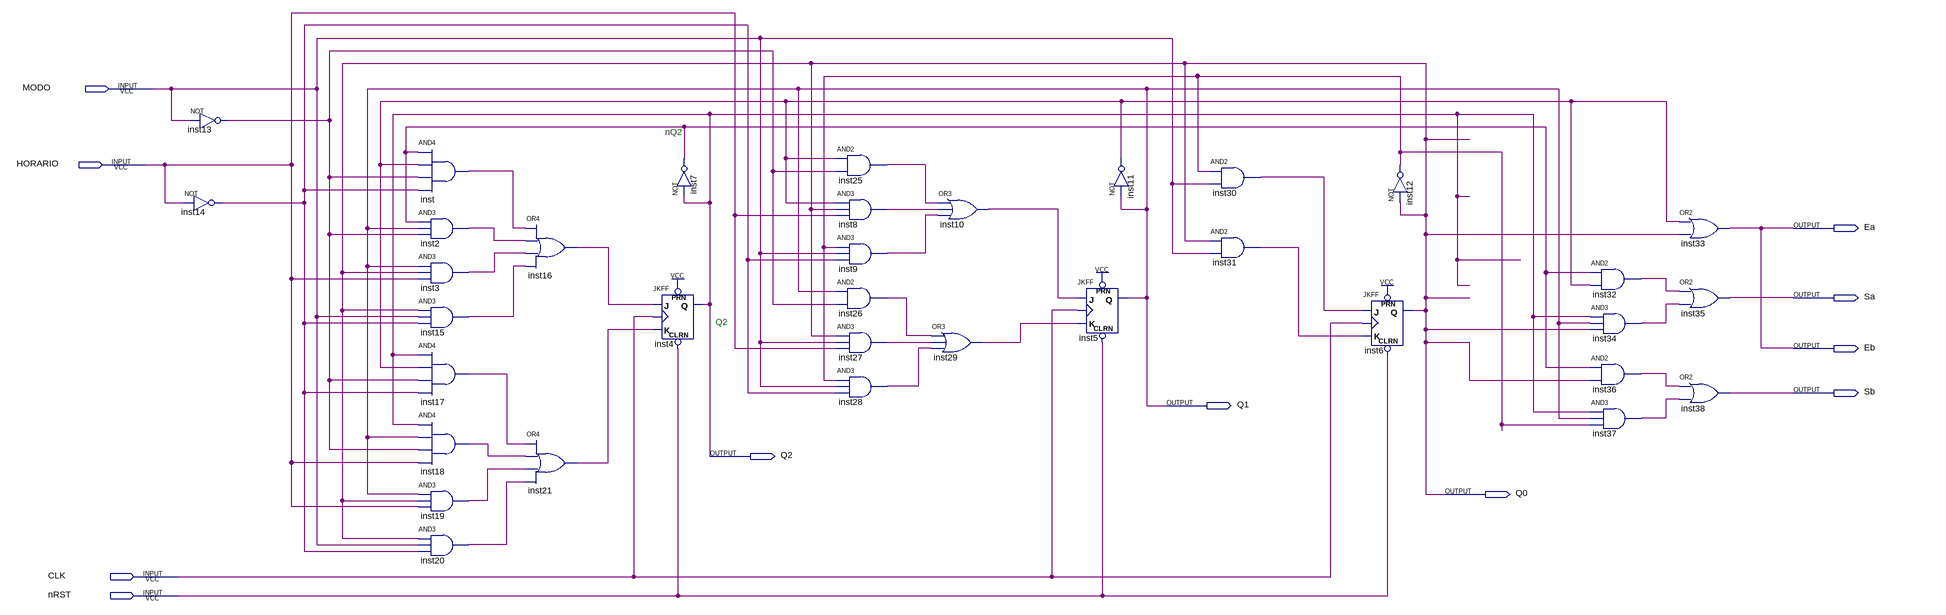
[diagram p0: schematic sheet]
// Quartus schematic controlador.bdf as structural Verilog: 35 symbols, 11 pins
module controlador (
  input  MODO,
  input  HORARIO,
  input  CLK,
  input  nRST,
  output Ea,
  output Sa,
  output Eb,
  output Sb,
  output Q1,
  output Q2,
  output Q0
);

  wire inst2_out, inst3_out, inst7_out, inst8_out, inst9_out, inst10_out, inst11_out, inst12_out, inst13_out,
       inst14_out, inst15_out, inst16_out, inst17_out, inst18_out, inst19_out, inst20_out, inst21_out,
       inst25_out, inst26_out, inst27_out, inst28_out, inst29_out, inst30_out, inst31_out, inst32_out,
       inst34_out, inst36_out, inst37_out, inst_out;

  not inst13 (inst13_out, MODO);
  not inst14 (inst14_out, HORARIO);
  and inst (inst_out, inst7_out, inst11_out, inst13_out, inst14_out);
  and inst2 (inst2_out, inst7_out, Q1, inst13_out);
  and inst3 (inst3_out, Q1, Q0, HORARIO);
  and inst15 (inst15_out, Q0, MODO, inst14_out);
  and inst17 (inst17_out, Q2, inst11_out, inst13_out, inst14_out);
  and inst18 (inst18_out, Q2, Q1, inst13_out, HORARIO);
  and inst19 (inst19_out, Q1, Q0, HORARIO);
  and inst20 (inst20_out, Q0, MODO, inst14_out);
  or inst16 (inst16_out, inst_out, inst2_out, inst3_out, inst15_out);
  or inst21 (inst21_out, inst17_out, inst18_out, inst19_out, inst20_out);
  not inst7 (inst7_out, Q2);
  JKFF inst4 (.PRN(1'b1), .CLRN(nRST), .K(inst21_out), .J(inst16_out), .CLK(CLK), .Q(Q2));
  and inst25 (inst25_out, inst11_out, inst13_out);
  and inst8 (inst8_out, inst11_out, Q0, HORARIO);
  and inst9 (inst9_out, inst12_out, MODO, inst14_out);
  and inst26 (inst26_out, Q1, inst13_out);
  and inst27 (inst27_out, Q0, MODO, HORARIO);
  and inst28 (inst28_out, inst12_out, MODO, inst14_out);
  or inst10 (inst10_out, inst25_out, inst8_out, inst9_out);
  or inst29 (inst29_out, inst26_out, inst27_out, inst28_out);
  JKFF inst5 (.PRN(1'b1), .CLRN(nRST), .K(inst29_out), .J(inst10_out), .CLK(CLK), .Q(Q1));
  not inst11 (inst11_out, Q1);
  and inst30 (inst30_out, inst12_out, MODO);
  and inst31 (inst31_out, Q0, MODO);
  not inst12 (inst12_out, Q0);
  JKFF inst6 (.PRN(1'b1), .CLRN(nRST), .K(inst31_out), .J(inst30_out), .CLK(CLK), .Q(Q0));
  and inst32 (inst32_out, inst7_out, inst11_out);
  and inst34 (inst34_out, Q2, Q1, Q0);
  and inst36 (inst36_out, inst7_out, Q0);
  and inst37 (inst37_out, Q2, Q1, inst12_out);
  or inst33 (Ea, inst11_out, Q0);
  or inst35 (Sa, inst32_out, inst34_out);
  or inst38 (Sb, inst36_out, inst37_out);

  assign Eb = Ea;

  // Notes on the sheet:
  //   nQ2
  //   Q2
endmodule
